# Altium schematic sheet Sensor Input.SchDoc
size A
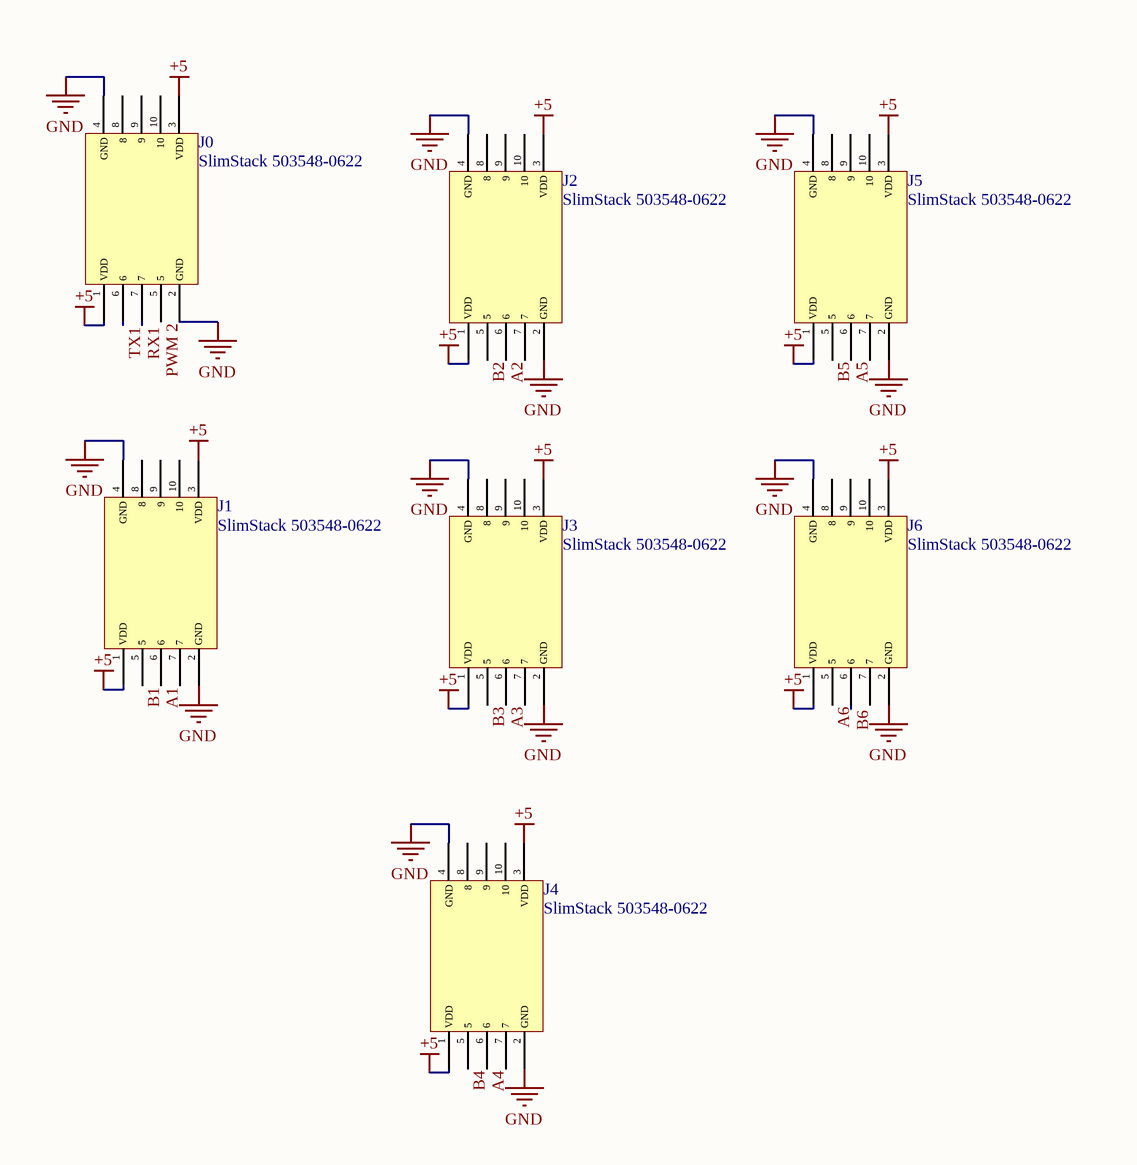
[diagram p0: Sensor Input.SchDoc]

## Parts
J0  SlimStack 503548-0622  [SlimStack_503548-0622]
J1  SlimStack 503548-0622  [SlimStack_503548-0622]
J2  SlimStack 503548-0622  [SlimStack_503548-0622]
J3  SlimStack 503548-0622  [SlimStack_503548-0622]
J4  SlimStack 503548-0622  [SlimStack_503548-0622]
J5  SlimStack 503548-0622  [SlimStack_503548-0622]
J6  SlimStack 503548-0622  [SlimStack_503548-0622]

## Nets
+5: J0.1(VDD) J0.3(VDD) J1.1(VDD) J1.3(VDD) J2.1(VDD) J2.3(VDD) J3.1(VDD) J3.3(VDD) J4.1(VDD) J4.3(VDD) J5.1(VDD) J5.3(VDD) J6.1(VDD) J6.3(VDD)
GND: J0.2(GND) J0.4(GND) J1.2(GND) J1.4(GND) J2.2(GND) J2.4(GND) J3.2(GND) J3.4(GND) J4.2(GND) J4.4(GND) J5.2(GND) J5.4(GND) J6.2(GND) J6.4(GND)
A1: J1.6
A2: J2.6
A3: J3.6
A4: J4.6
A5: J5.6
A6: J6.5
B1: J1.5
B2: J2.5
B3: J3.5
B4: J4.5
B5: J5.5
B6: J6.6
PWM 2: J0.5
RX1: J0.7
TX1: J0.6

Not connected (* = marked no-connect by the designer): J0 8 9 10; J1 7 8 9 10; J2 7 8 9 10; J3 7 8 9 10; J4 7 8 9 10; J5 7 8 9 10; J6 7 8 9 10

## Library data of the parts
J0-J6 = SlimStack_503548-0622